# Altium schematic sheet Thiet_bi_giam_sat_IOT.SchDoc (part 1 of 3)
size 863 x 558 mm; SheetNumber: 1; SheetTotal: 1
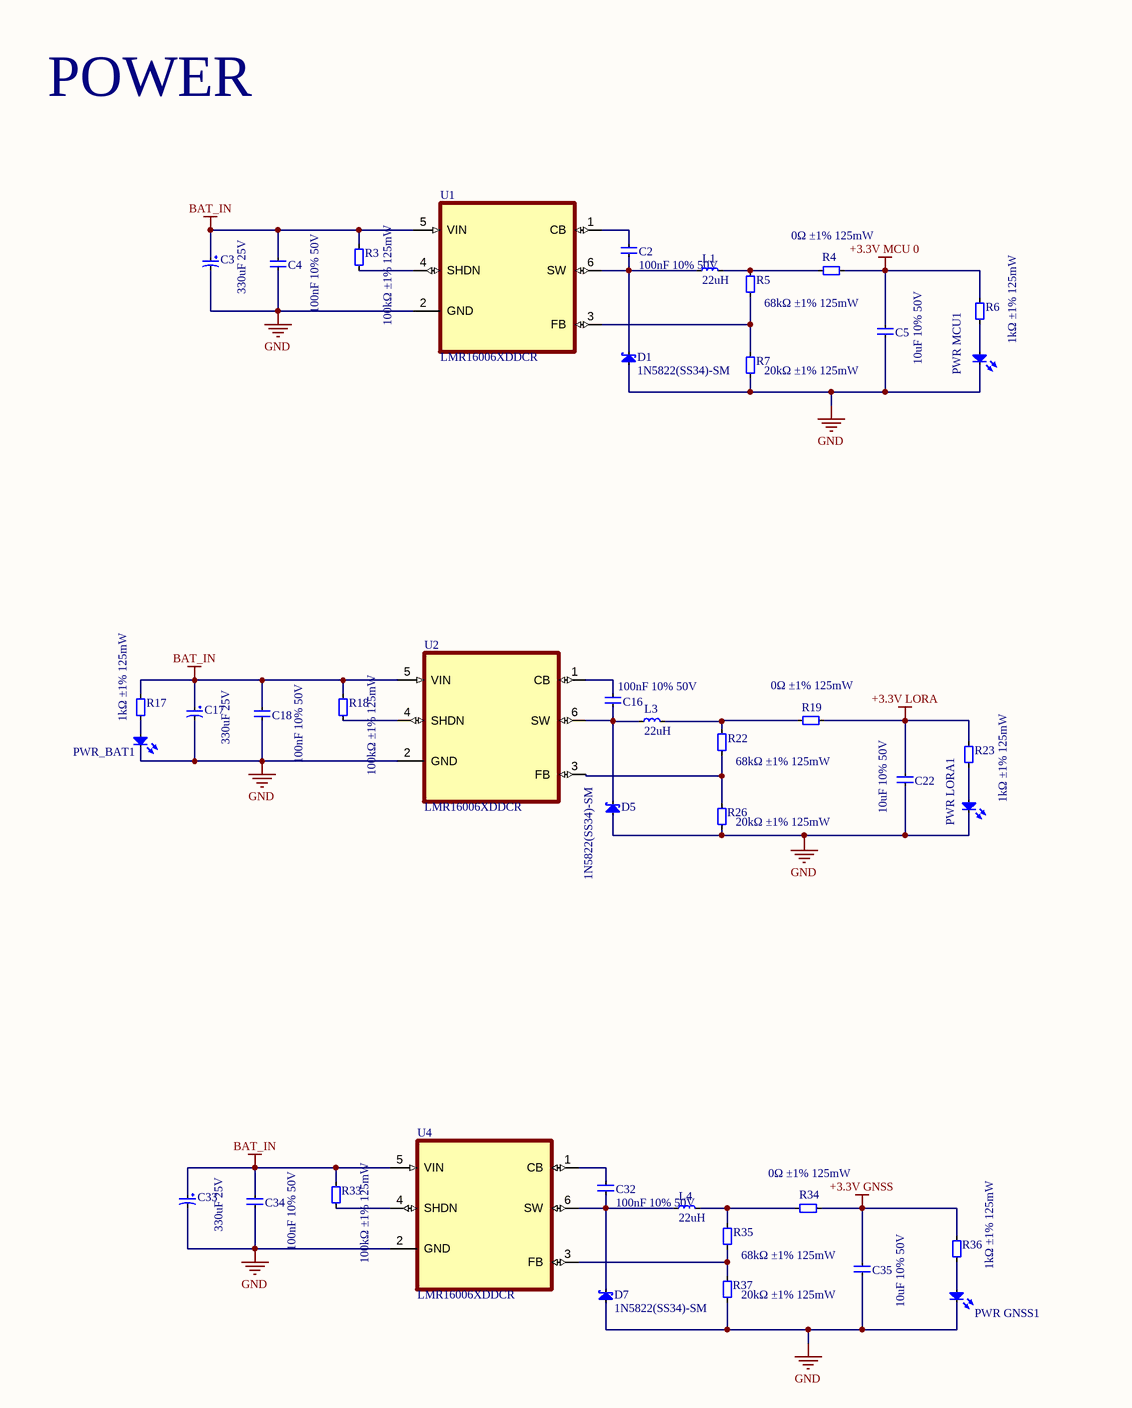
[diagram p0: Thiet_bi_giam_sat_IOT.SchDoc, top left]
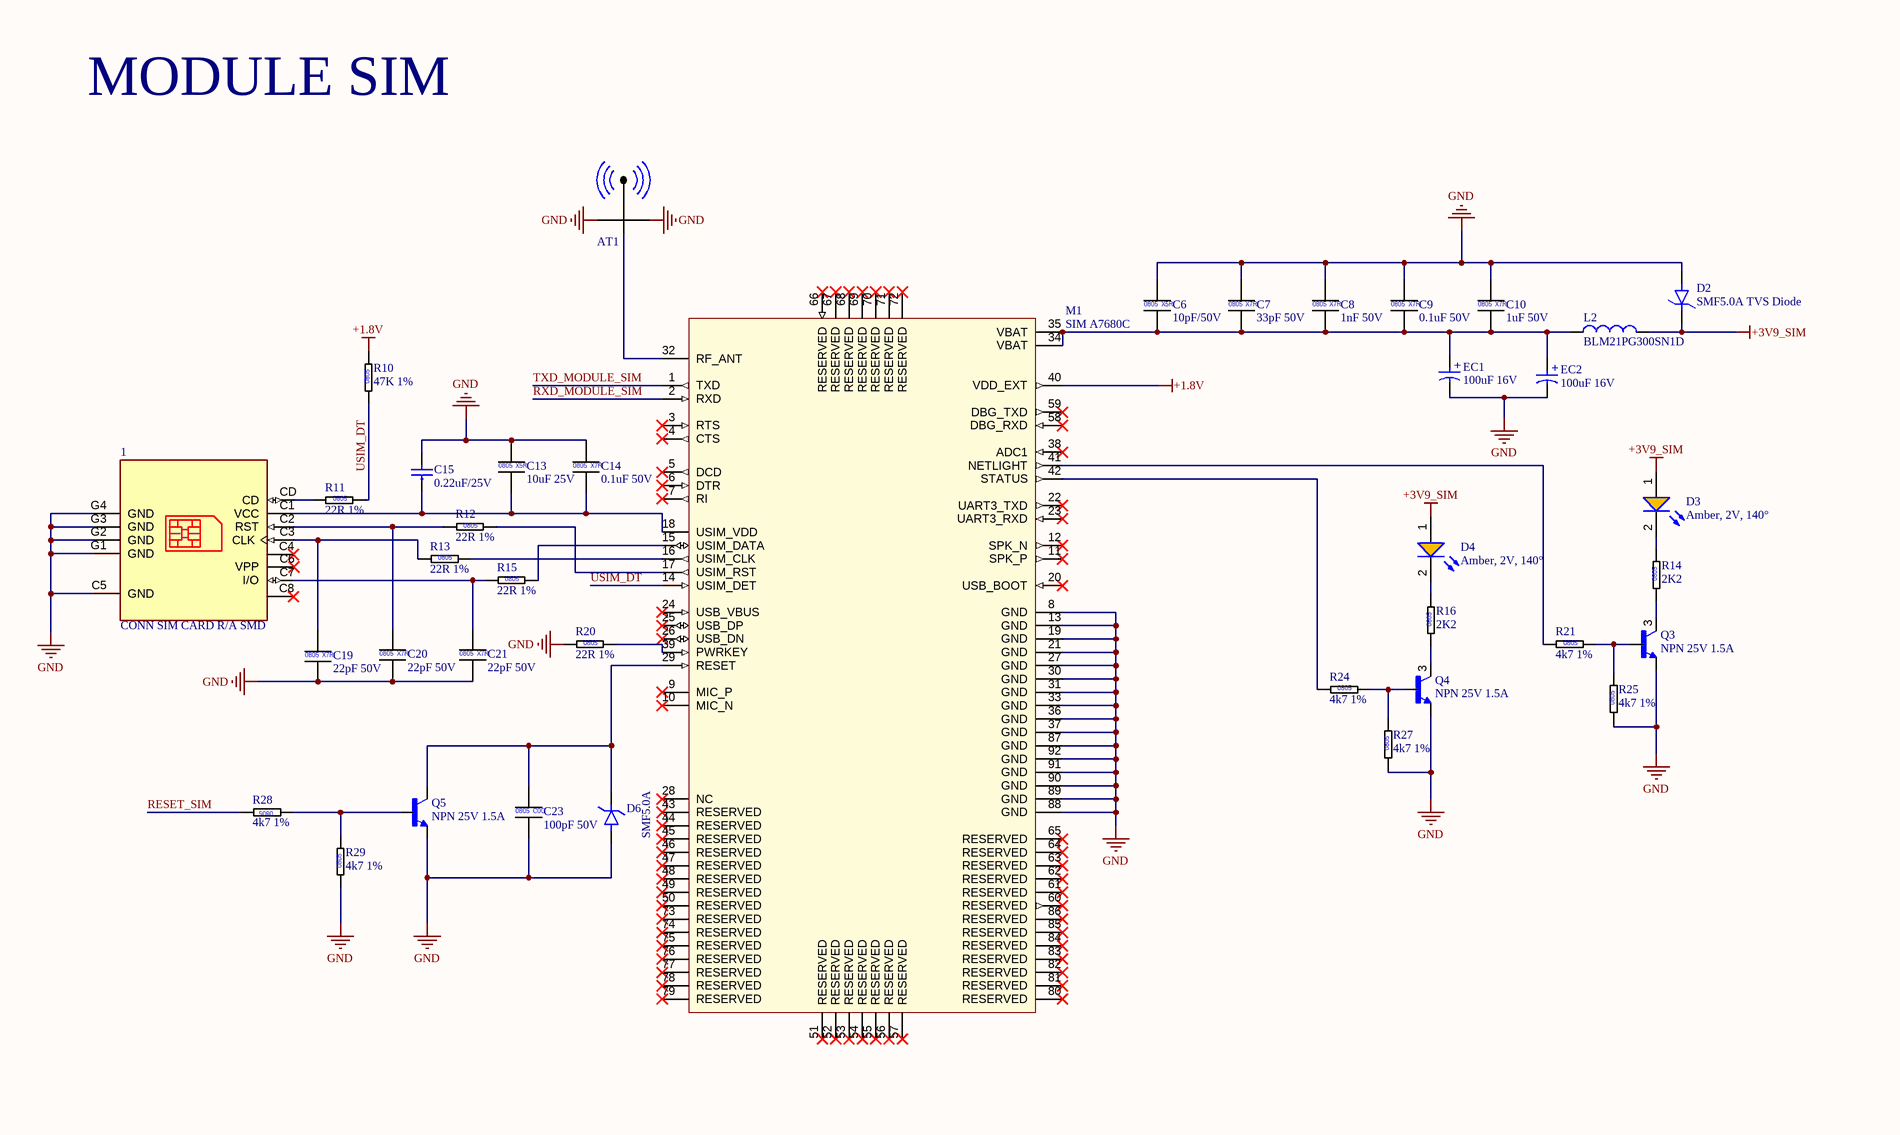
[diagram p1: Thiet_bi_giam_sat_IOT.SchDoc, top middle]
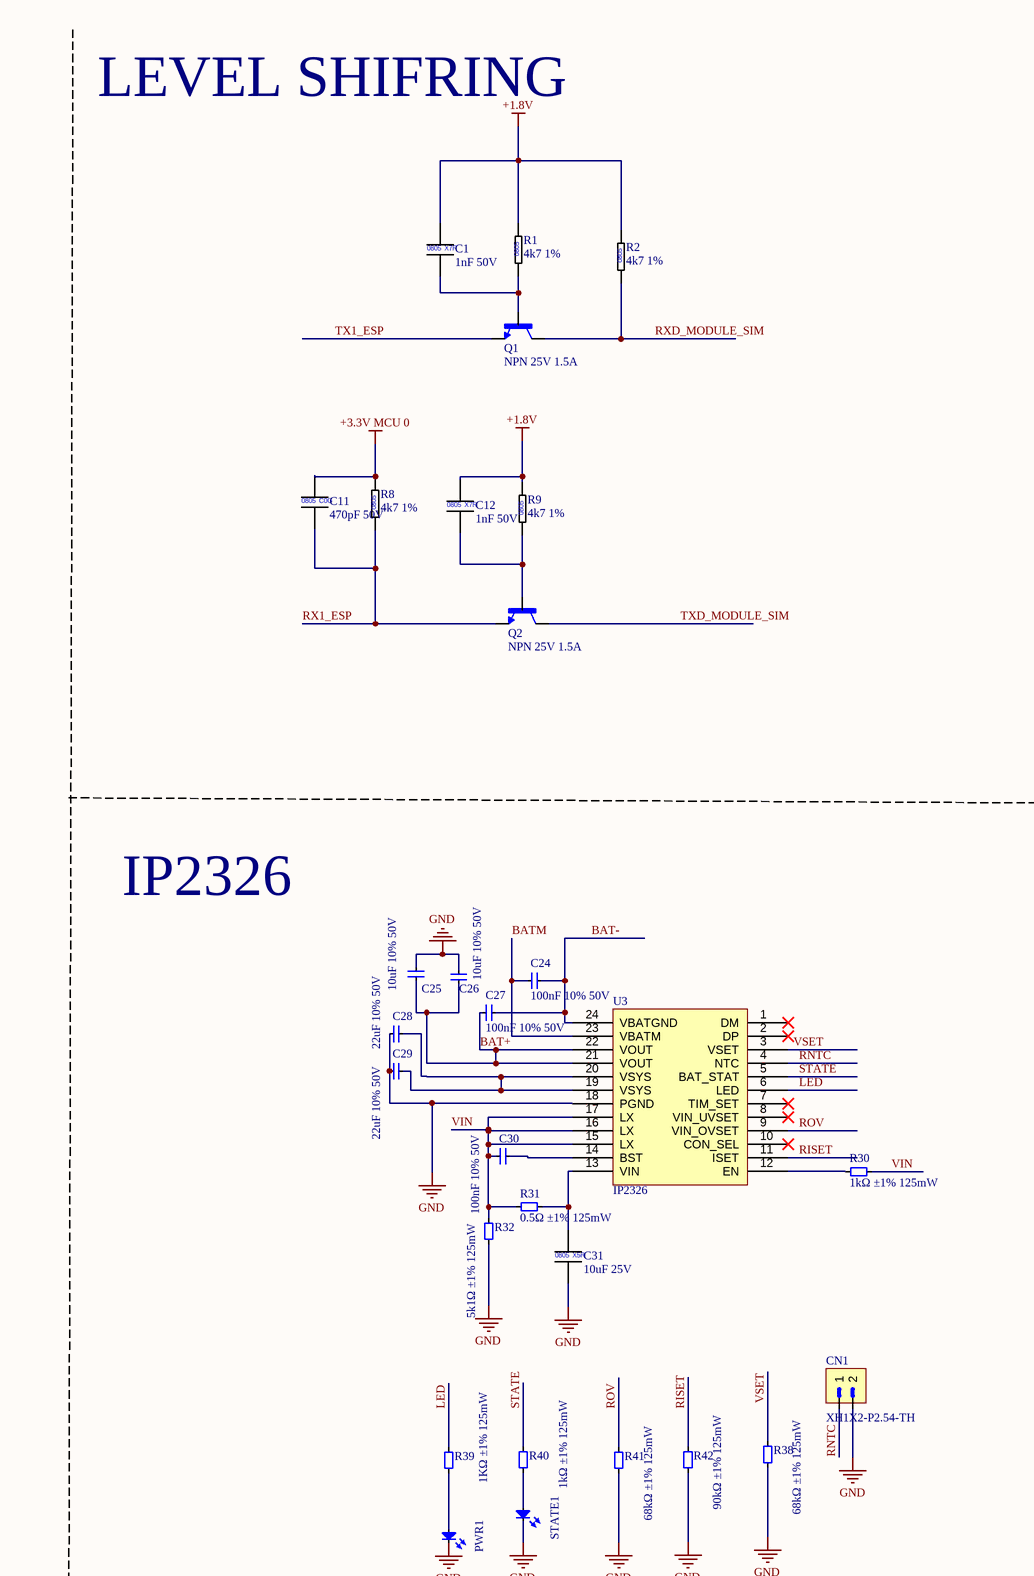
[diagram p2: Thiet_bi_giam_sat_IOT.SchDoc, top right]
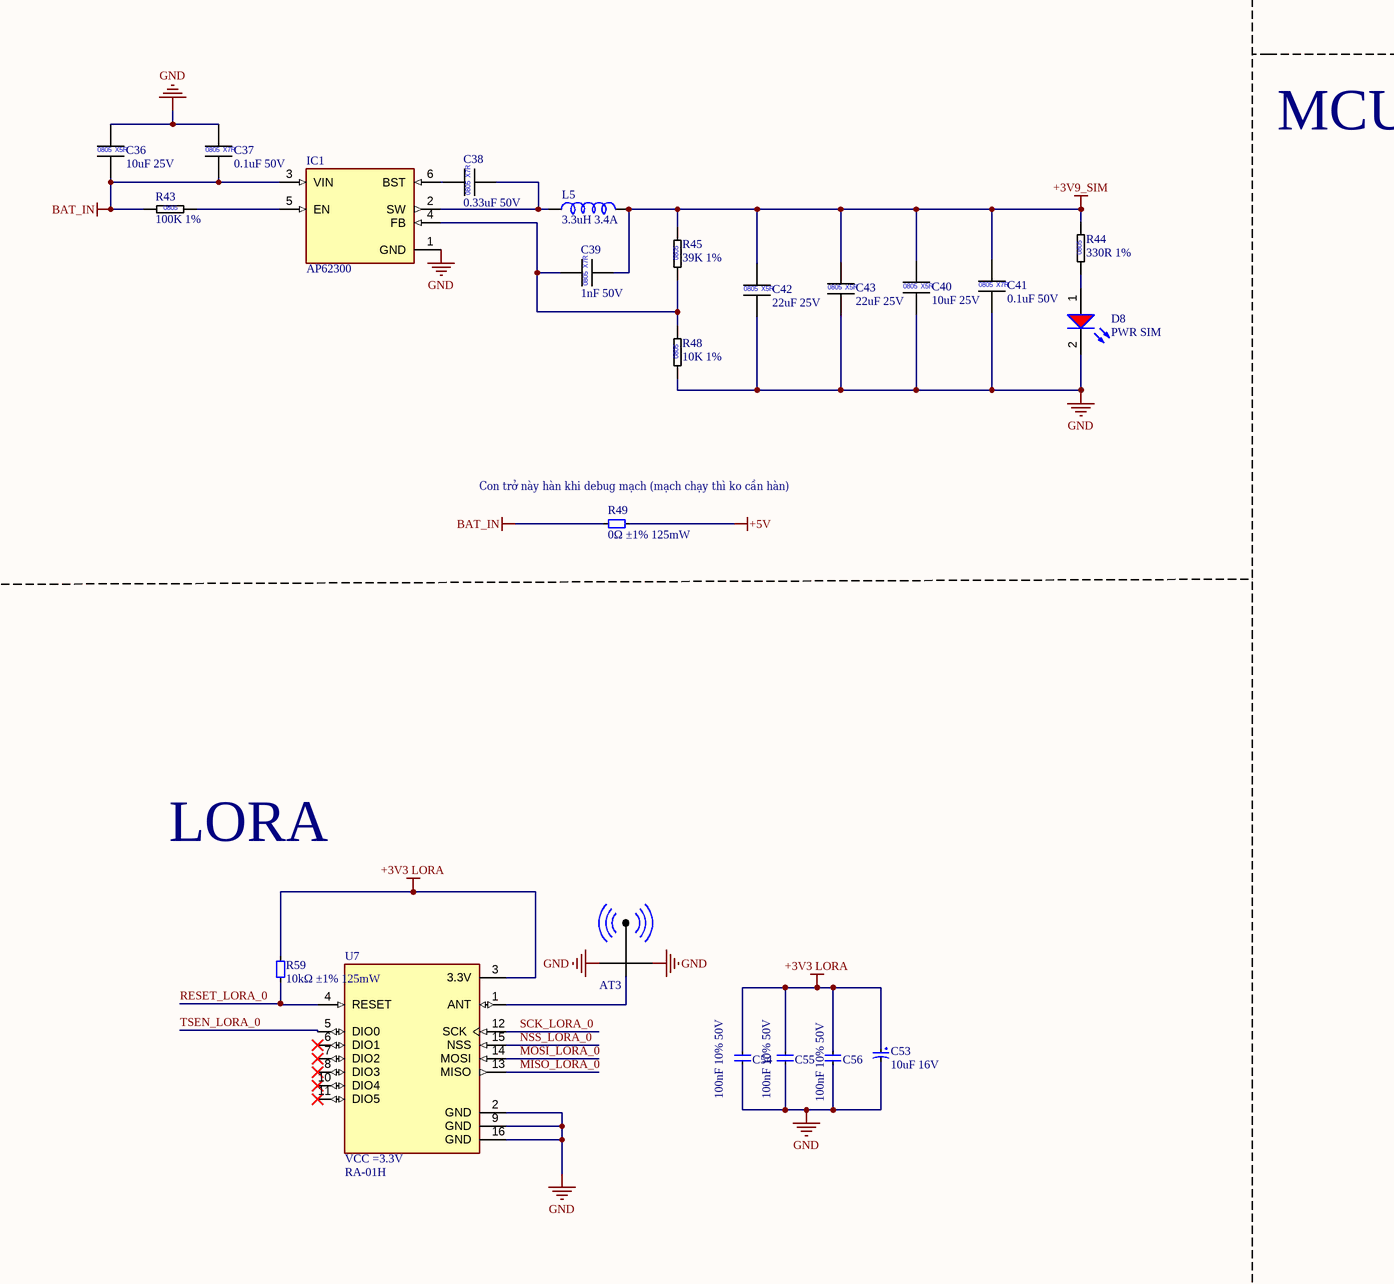
[diagram p3: Thiet_bi_giam_sat_IOT.SchDoc, bottom left]
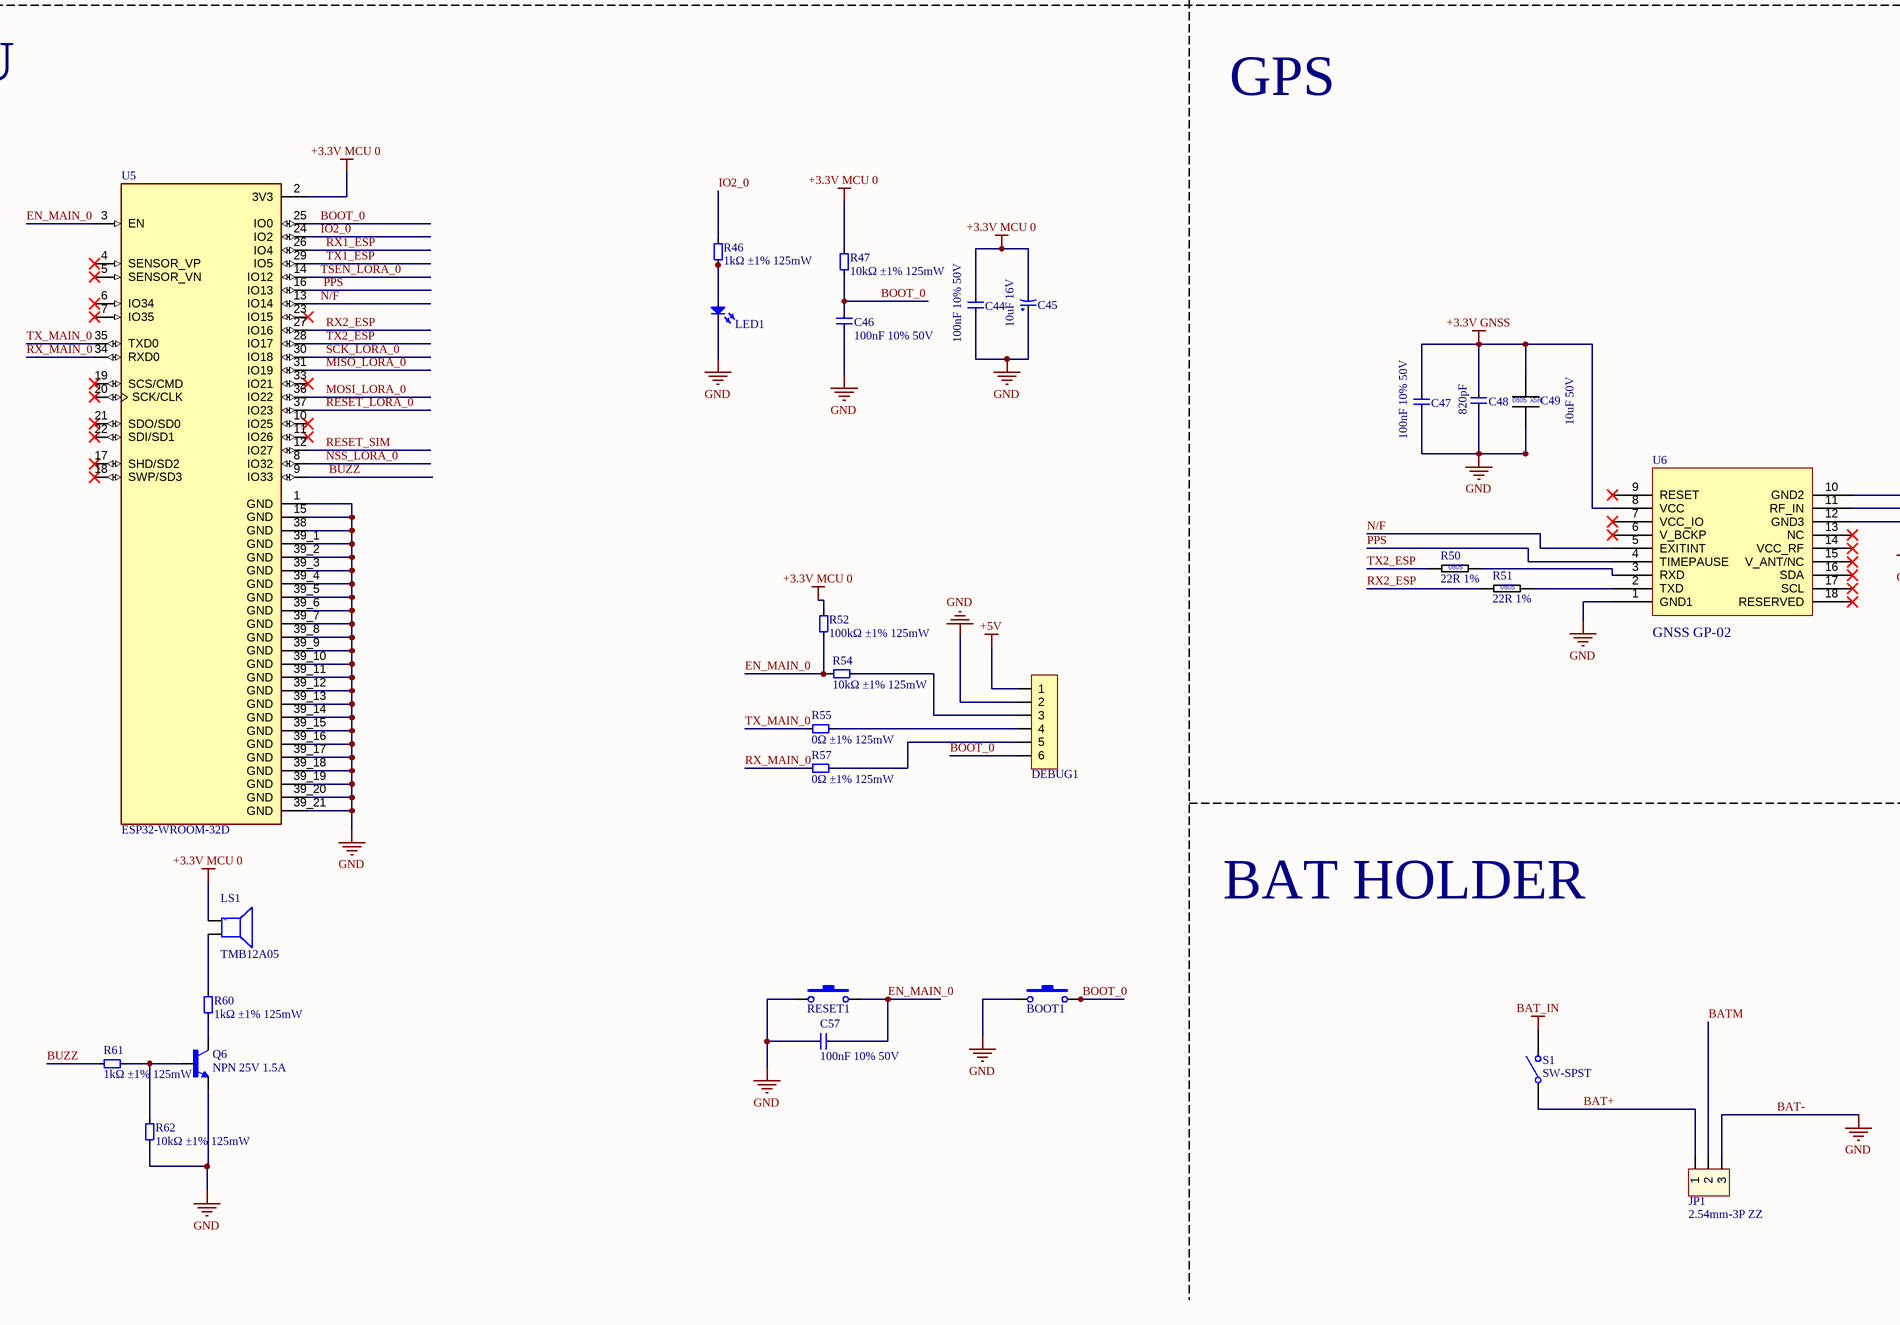
[diagram p4: Thiet_bi_giam_sat_IOT.SchDoc, bottom middle]
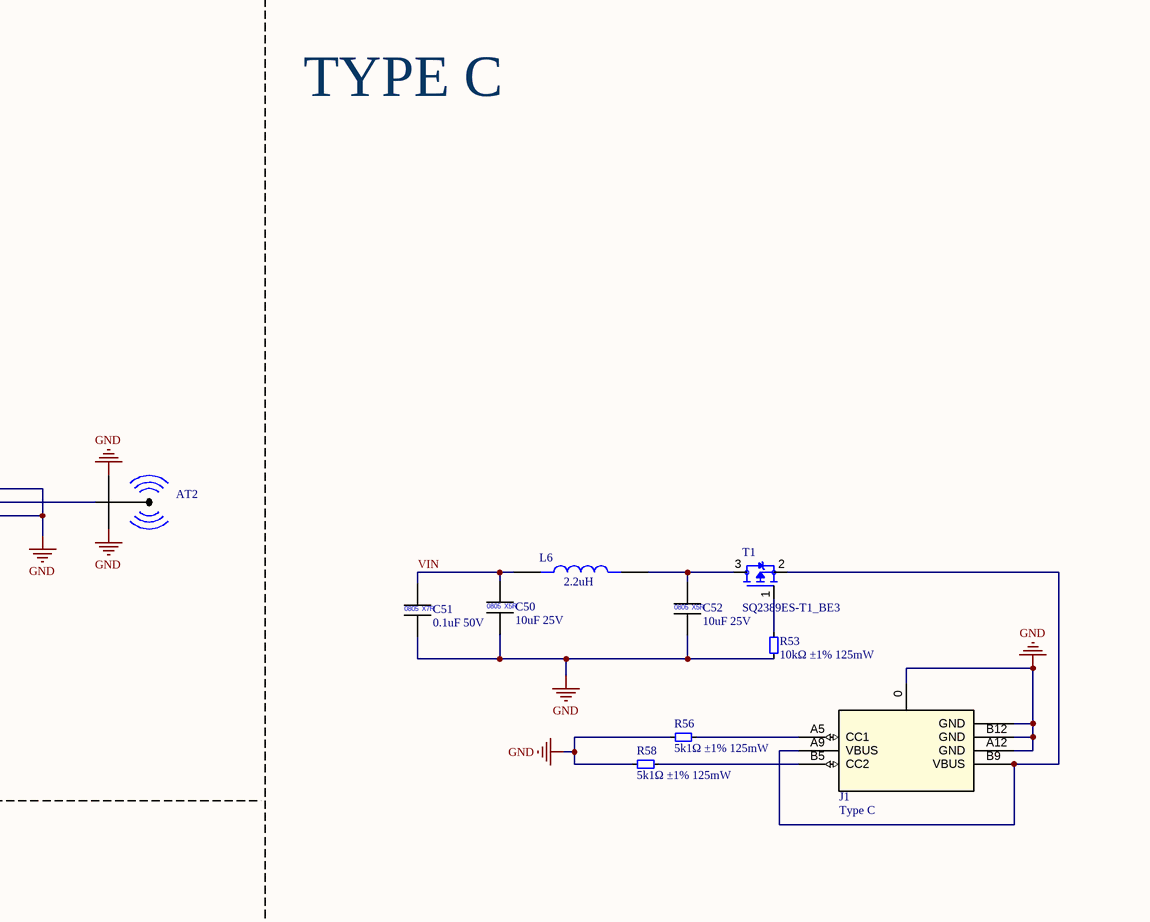
[diagram p5: Thiet_bi_giam_sat_IOT.SchDoc, bottom right]

## Parts
1  CONN SIM CARD R/A SMD  [SIM HOLDER 9P]
AT1  Antenna_IPEX  [IPEX]  (value not drawn)
AT2  Antenna_IPEX  [IPEX]  (value not drawn)
AT3  Antenna_IPEX  [IPEX]  (value not drawn)
BOOT1  Nut Nhan 2 Chan SMD 3x6x2.5  [Nut Nhan 2 Chan SMD 3x6x2.5]  (value not drawn)
C1  1nF 50V  [CAP-CER_0805_L2W1.25H0.6_Wave]
C2  100nF 10% 50V  [C-CHIP-0805-T0.95-SM]
C3  330uF 25V  [C-ELEC-ALU-F-D8.0-H10.2-SM]
C4  100nF 10% 50V  [C-CHIP-0805-T0.95-SM]
C5  10uF 10% 50V  [C-CHIP-1206-T1.00-SM]
C6  10pF/50V  [CAP-CER_0805_L2W1.25H0.6_Wave]
C7  33pF 50V  [CAP-CER_0805_L2W1.25H0.6_Wave]
C8  1nF 50V  [CAP-CER_0805_L2W1.25H0.6_Wave]
C9  0.1uF 50V  [CAP-CER_0805_L2W1.25H0.6_Wave]
C10  1uF 50V  [CAP-CER_0805_L2W1.25H0.8_Wave]
C11  470pF 50V  [CAP-CER_0805_L2W1.25H0.6_Wave]
C12  1nF 50V  [CAP-CER_0805_L2W1.25H0.6_Wave]
C13  10uF 25V  [CAP-CER_0805_L2W1.25H0.8_Wave]
C14  0.1uF 50V  [CAP-CER_0805_L2W1.25H0.6_Wave]
C15  0.22uF/25V  [CAP-CER0805-1.4H]
C16  100nF 10% 50V  [C-CHIP-0805-T0.95-SM]
C17  330uF 25V  [C-ELEC-ALU-F-D8.0-H10.2-SM]
C18  100nF 10% 50V  [C-CHIP-0805-T0.95-SM]
C19  22pF 50V  [CAP-CER_0805_L2W1.25H0.6_Wave]
C20  22pF 50V  [CAP-CER_0805_L2W1.25H0.6_Wave]
C21  22pF 50V  [CAP-CER_0805_L2W1.25H0.6_Wave]
C22  10uF 10% 50V  [C-CHIP-1206-T1.00-SM]
C23  100pF 50V  [CAP-CER_0805_L2W1.25H0.6_Wave]
C24  100nF 10% 50V  [C-CHIP-0805-T0.95-SM]
C25  10uF 10% 50V  [C-CHIP-0805-T0.95-SM]
C26  10uF 10% 50V  [C-CHIP-0805-T0.95-SM]
C27  100nF 10% 50V  [C-CHIP-0805-T0.95-SM]
C28  22uF 10% 50V  [C-CHIP-0805-T0.95-SM]
C29  22uF 10% 50V  [C-CHIP-0805-T0.95-SM]
C30  100nF 10% 50V  [C-CHIP-0805-T0.95-SM]
C31  10uF 25V  [CAP-CER_0805_L2W1.25H0.8_Wave]
C32  100nF 10% 50V  [C-CHIP-0805-T0.95-SM]
C33  330uF 25V  [C-ELEC-ALU-F-D8.0-H10.2-SM]
C34  100nF 10% 50V  [C-CHIP-0805-T0.95-SM]
C35  10uF 10% 50V  [C-CHIP-1206-T1.00-SM]
C36  10uF 25V  [CAP-CER_0805_L2W1.25H0.8_Wave]
C37  0.1uF 50V  [CAP-CER_0805_L2W1.25H0.6_Wave]
C38  0.33uF 50V  [CAP-CER_0805_L2W1.25H0.6_Wave]
C39  1nF 50V  [CAP-CER_0805_L2W1.25H0.6_Wave]
C40  10uF 25V  [CAP-CER_0805_L2W1.25H0.8_Wave]
C41  0.1uF 50V  [CAP-CER_0805_L2W1.25H0.6_Wave]
C42  22uF 25V  [CAP-CER_0805_L2W1.25H0.6_Wave]
C43  22uF 25V  [CAP-CER_0805_L2W1.25H0.6_Wave]
C44  100nF 10% 50V  [C-CHIP-0805-T0.95-SM]
C45  10uF 16V  [C-ELEC-ALU-B-D4.0-H5.4-SM]
C46  100nF 10% 50V  [C-CHIP-0805-T0.95-SM]
C47  100nF 10% 50V  [C-CHIP-0805-T0.95-SM]
C48  820pF  [C-CHIP-0805-T0.95-SM]
C49  10uF 50V  [CAP-CER_0805_L2W1.25H0.8_Wave]
C50  10uF 25V  [CAP-CER_0805_L2W1.25H0.8_Wave]
C51  0.1uF 50V  [CAP-CER_0805_L2W1.25H0.6_Wave]
C52  10uF 25V  [CAP-CER_0805_L2W1.25H0.8_Wave]
C53  10uF 16V  [C-ELEC-ALU-B-D4.0-H5.4-SM]
C54  100nF 10% 50V  [C-CHIP-0805-T0.95-SM]
C55  100nF 10% 50V  [C-CHIP-0805-T0.95-SM]
C56  100nF 10% 50V  [C-CHIP-0805-T0.95-SM]
C57  100nF 10% 50V  [C-CHIP-0805-T0.95-SM]
CN1  XH1X2-P2.54-TH  [XH1X2M-P2.54-TH]
D1  1N5822(SS34)-SM  [SMA-J_DO-214AC]
D2  SMF5.0A TVS Diode  [SOD-123]
D3  Amber, 2V, 140°  [LED_0805_AMBER]
D4  Amber, 2V, 140°  [LED_0805_AMBER]
D5  1N5822(SS34)-SM  [SMA-J_DO-214AC]
D6  SMF5.0A  [SOD-123F/SOD-123FL]
D7  1N5822(SS34)-SM  [SMA-J_DO-214AC]
D8  PWR SIM  [LED_0805_RED]
DEBUG1  DEBUG  [JP1x6F-P2.54-TH]  (value not drawn)
EC1  100uF 16V  [CAP_ALU;SMD,D6.3H5.8]
EC2  100uF 16V  [CAP_ALU;SMD,D6.3H5.8]
IC1  AP62300  [SOT-23-6]
J1  Type C  [USB_C_6P_2.00]
JP1  value 2.54mm-3P ZZ  [CONN_DIP; 3P_2.54mm; 90 DEGREE ; Black]  (hidden comment: 2.54mm-7P ZZ)
L1  22uH  [L-WIRE-CDRH74R-SM]
L2  BLM21PG300SN1D  [FB_0805_L2W1.2H0.9_HC]
L3  22uH  [L-WIRE-CDRH74R-SM]
L4  22uH  [L-WIRE-CDRH74R-SM]
L5  3.3uH 3.4A  [IND_SMD 6x6x2.8MM]
L6  2.2uH  [IND_LQH43PH2R2M26L]
LED1  LED-CHIP-SM  [LED-CHIP-0805-RD-SM]  (value not drawn)
LS1  TMB12A05  [Pin2]
M1  SIM A7680C  [IC_SIM_A7682S/A7680C - duplicate]
PWR1  LED-CHIP-SM  [LED-CHIP-0805-RD-SM]  (value not drawn)
PWR_BAT1  LED-CHIP-SM  [LED-CHIP-0805-RD-SM]  (value not drawn)
PWR_GNSS1  LED-CHIP-SM  [LED-CHIP-0805-RD-SM]  (value not drawn)
PWR_LORA1  LED-CHIP-SM  [LED-CHIP-0805-RD-SM]  (value not drawn)
PWR_MCU1  LED-CHIP-SM  [LED-CHIP-0805-RD-SM]  (value not drawn)
Q1  NPN 25V 1.5A  [MOS-FET; SOT23]
Q2  NPN 25V 1.5A  [MOS-FET; SOT23]
Q3  NPN 25V 1.5A  [MOS-FET; SOT23]
Q4  NPN 25V 1.5A  [MOS-FET; SOT23]
Q5  NPN 25V 1.5A  [MOS-FET; SOT23]
Q6  NPN 25V 1.5A  [MOS-FET; SOT23]
R1  4k7 1%  [RESISTOR_0805_Wave]
R2  4k7 1%  [RESISTOR_0805_Wave]
R3  100kΩ ±1% 125mW  [R-CHIP-0805-SM]
R4  0Ω ±1% 125mW  [R-CHIP-0805-SM]
R5  68kΩ ±1% 125mW  [R-CHIP-0805-SM]
R6  1kΩ ±1% 125mW  [R-CHIP-0805-SM]
R7  20kΩ ±1% 125mW  [R-CHIP-0805-SM]
R8  4k7 1%  [RESISTOR_0805_Wave]
R9  4k7 1%  [RESISTOR_0805_Wave]
R10  47K 1%  [RESISTOR_0805_Wave]
R11  22R 1%  [RESISTOR_0805_Wave]
R12  22R 1%  [RESISTOR_0805_Wave]
R13  22R 1%  [RESISTOR_0805_Wave]
R14  2K2  [RESISTOR_0805_Wave]
R15  22R 1%  [RESISTOR_0805_Wave]
R16  2K2  [RESISTOR_0805_Wave]
R17  1kΩ ±1% 125mW  [R-CHIP-0805-SM]
R18  100kΩ ±1% 125mW  [R-CHIP-0805-SM]
R19  0Ω ±1% 125mW  [R-CHIP-0805-SM]
R20  22R 1%  [RESISTOR_0805_Wave]
R21  4k7 1%  [RESISTOR_0805_Wave]
R22  68kΩ ±1% 125mW  [R-CHIP-0805-SM]
R23  1kΩ ±1% 125mW  [R-CHIP-0805-SM]
R24  4k7 1%  [RESISTOR_0805_Wave]
R25  4k7 1%  [RESISTOR_0805_Wave]
R26  20kΩ ±1% 125mW  [R-CHIP-0805-SM]
R27  4k7 1%  [RESISTOR_0805_Wave]
R28  4k7 1%  [RESISTOR_0805_Wave]
R29  4k7 1%  [RESISTOR_0805_Wave]
R30  1kΩ ±1% 125mW  [R-CHIP-0805-SM]
R31  0.5Ω ±1% 125mW  [R-CHIP-0805-SM]
R32  5k1Ω ±1% 125mW  [R-CHIP-0805-SM]
R33  100kΩ ±1% 125mW  [R-CHIP-0805-SM]
R34  0Ω ±1% 125mW  [R-CHIP-0805-SM]
R35  68kΩ ±1% 125mW  [R-CHIP-0805-SM]
R36  1kΩ ±1% 125mW  [R-CHIP-0805-SM]
R37  20kΩ ±1% 125mW  [R-CHIP-0805-SM]
R38  68kΩ ±1% 125mW  [R-CHIP-0805-SM]
R39  1KΩ ±1% 125mW  [R-CHIP-0805-SM]
R40  1kΩ ±1% 125mW  [R-CHIP-0805-SM]
R41  68kΩ ±1% 125mW  [R-CHIP-0805-SM]
R42  90kΩ ±1% 125mW  [R-CHIP-0805-SM]
R43  100K 1%  [RESISTOR_0805_Wave]
R44  330R 1%  [RESISTOR_0805_Wave]
R45  39K 1%  [RESISTOR_0805_Wave]
R46  1kΩ ±1% 125mW  [R-CHIP-0805-SM]
R47  10kΩ ±1% 125mW  [R-CHIP-0805-SM]
R48  10K 1%  [RESISTOR_0805_Wave]
R49  0Ω ±1% 125mW  [R-CHIP-0805-SM]
R50  22R 1%  [RESISTOR_0805_Wave]
R51  22R 1%  [RESISTOR_0805_Wave]
R52  100kΩ ±1% 125mW  [R-CHIP-0805-SM]
R53  10kΩ ±1% 125mW  [R-CHIP-0805-SM]
R54  10kΩ ±1% 125mW  [R-CHIP-0805-SM]
R55  0Ω ±1% 125mW  [R-CHIP-0805-SM]
R56  5k1Ω ±1% 125mW  [R-CHIP-0805-SM]
R57  0Ω ±1% 125mW  [R-CHIP-0805-SM]
R58  5k1Ω ±1% 125mW  [R-CHIP-0805-SM]
R59  10kΩ ±1% 125mW  [R-CHIP-0805-SM]
R60  1kΩ ±1% 125mW  [R-CHIP-0805-SM]
R61  1kΩ ±1% 125mW  [R-CHIP-0805-SM]
R62  10kΩ ±1% 125mW  [R-CHIP-0805-SM]
RESET1  Nut Nhan 2 Chan SMD 3x6x2.5  [Nut Nhan 2 Chan SMD 3x6x2.5]  (value not drawn)
S1  SW-SPST  [SPST-2]
STATE1  LED-CHIP-SM  [LED-CHIP-0805-RD-SM]  (value not drawn)
T1  SQ2389ES-T1_BE3  [SOT-23]
U1  LMR16006XDDCR  [SOT-6L]
U2  LMR16006XDDCR  [SOT-6L]
U3  IP2326  [IP2326]
U4  LMR16006XDDCR  [SOT-6L]
U5  ESP32-WROOM-32D  [MCU_ESP32-WROOM-32D]
U6  GNSS GP-02  [GNSS_GP-02]  (value not drawn)
U7  VCC =3.3V  Manufacture Part Number: RA-01H  [MCU_RA-01H]

## Nets
+1.8V: C1.1 C12.1 M1.40(VDD_EXT) R1.2 R2.2 R9.2 R10.2
+3.3V GNSS: C35.2 C47.2 C48.2 C49.1 R34.2 R36.2 U6.8(VCC)
+3.3V LORA: C22.2 R19.2 R23.2
+3.3V MCU 0: C5.2 C11.1 C44.2 C45.2 LS1.1(+) R4.2 R6.2 R8.2 R47.2 R52.2 U5.2(3V3)
+3V3 LORA: C53.1 C54.2 C55.2 C56.2 R59.2 U7.3(3.3V)
+3V9_SIM: C39.2 C40.1 C41.1 C42.1 C43.1 D2.2(K) D3.1(A) D4.1(A) L2.2 L5.2 R44.2 R45.2
+5V: DEBUG1.1 R49.2
BAT-: 1.C5(GND) 1.G1(GND) 1.G2(GND) 1.G3(GND) 1.G4(GND) AT1.2(GND) AT2.2(GND) AT3.2(GND) BOOT1.1 C3.2 C4.1 C5.1 C6.1 C7.1 C8.1 C9.1 C10.1 C13.1 C14.1 C15.2 C17.2 C18.1 C19.2 C20.2 C21.2 C22.1 C23.2 C24.2 C25.2 C26.2 C27.2 C28.1 C29.1 C31.2 C33.2 C34.1 C35.1 C36.1 C37.1 C40.2 C41.2 C42.2 C43.2 C44.1 C45.1 C46.1 C47.1 C48.1 C49.2 C50.2 C51.2 C52.2 C53.2 C54.1 C55.1 C56.1 C57.2 CN1.2 D1.1 D2.1(A) D5.1 D6.1(A) D7.1 D8.2(K) DEBUG1.2 EC1.2(N) EC2.2(N) IC1.1(GND) J1.0(GND) J1.A12(GND) J1.B12(GND) JP1.3 LED1.2 M1.8(GND) M1.13(GND) M1.19(GND) M1.21(GND) M1.27(GND) M1.30(GND) M1.31(GND) M1.33(GND) M1.36(GND) M1.37(GND) M1.87(GND) M1.88(GND) M1.89(GND) M1.90(GND) M1.91(GND) M1.92(GND) PWR1.2 PWR_BAT1.2 PWR_GNSS1.2 PWR_LORA1.2 PWR_MCU1.2 Q3.2(E) Q4.2(E) Q5.2(E) Q6.2(E) R7.1 R20.1 R25.1 R26.1 R27.1 R29.1 R32.1 R37.1 R38.1 R41.1 R42.1 R48.1 R53.1 R56.1 R58.1 R62.1 RESET1.1 STATE1.2 U1.2(GND) U2.2(GND) U3.18(PGND) U3.24(VBATGND) U4.2(GND) U5.1(GND) U5.15(GND) U5.38(GND) U5.39_1(GND) U5.39_2(GND) U5.39_3(GND) U5.39_4(GND) U5.39_5(GND) U5.39_6(GND) U5.39_7(GND) U5.39_8(GND) U5.39_9(GND) U5.39_10(GND) U5.39_11(GND) U5.39_12(GND) U5.39_13(GND) U5.39_14(GND) U5.39_15(GND) U5.39_16(GND) U5.39_17(GND) U5.39_18(GND) U5.39_19(GND) U5.39_20(GND) U5.39_21(GND) U6.1(GND1) U6.10(GND2) U6.12(GND3) U7.2(GND) U7.9(GND) U7.16(GND)  [also labelled GND]
BAT_IN: C3.1 C4.2 C17.1 C18.2 C33.1 C34.2 C36.2 C37.2 IC1.3(VIN) R3.2 R17.2 R18.2 R33.2 R43.1 R49.1 S1.2(NO) U1.5(VIN) U2.5(VIN) U4.5(VIN)
BAT+: C25.1 C26.1 C27.1 JP1.1 S1.1(COMMON) U3.21(VOUT) U3.22(VOUT)
BATM: C24.1 JP1.2 U3.23(VBATM)
BOOT_0: BOOT1.2 C46.2 DEBUG1.6 R47.1 U5.25(IO0)
BUZZ: R61.2 U5.9(IO33)
EN_MAIN_0: C57.1 R52.1 R54.1 RESET1.2 U5.3(EN)
IO2_0: R46.2 U5.24(IO2)
LED: R39.2 U3.6(LED)
MISO_LORA_0: U5.31(IO19) U7.13(MISO)
MOSI_LORA_0: U5.36(IO22) U7.14(MOSI)
N/F: U5.13(IO14) U6.5(EXITINT)
NSS_LORA_0: U5.8(IO32) U7.15(NSS)
PPS: U5.16(IO13) U6.4(TIMEPAUSE)
RESET_LORA_0: R59.1 U5.37(IO23) U7.4(RESET)
RESET_SIM: R28.2 U5.12(IO27)
RISET: R42.2 U3.11(ISET)
RNTC: CN1.1 U3.4(NTC)
ROV: R41.2 U3.9(VIN_OVSET)
RX1_ESP: C11.2 Q2.2(E) R8.1 U5.26(IO4)
RX2_ESP: R51.1 U5.27(IO16)
RX_MAIN_0: R57.1 U5.34(RXD0)
RXD_MODULE_SIM: M1.2(RXD) Q1.3(C) R2.1
SCK_LORA_0: U5.30(IO18) U7.12(SCK)
STATE: R40.2 U3.5(BAT_STAT)
TSEN_LORA_0: U5.14(IO12) U7.5(DIO0)
TX1_ESP: Q1.2(E) U5.29(IO5)
TX2_ESP: R50.1 U5.28(IO17)
TX_MAIN_0: R55.1 U5.35(TXD0)
TXD_MODULE_SIM: M1.1(TXD) Q2.3(C)
USIM_DT: M1.14(USIM_DET) R10.1 R11.2
VIN: C30.1 C50.1 C51.1 L6.1 R30.2 R31.1 R32.2 U3.15(LX) U3.16(LX) U3.17(LX)
VSET: R38.2 U3.3(VSET)
Net1_C1: 1.C1(VCC) C13.2 C14.2 C15.1 M1.18(USIM_VDD)
Net1_C2: 1.C2(RST) C20.1 R12.1
Net1_C3: 1.C3(CLK) C19.1 R13.1
Net1_C7: 1.C7(I/O) C21.1 R15.1
Net1_CD: 1.CD R11.1
NetAT1_1: AT1.1(AT) M1.32(RF_ANT)
NetAT2_1: AT2.1(AT) U6.11(RF_IN)
NetAT3_1: AT3.1(AT) U7.1(ANT)
NetC1_2: C1.2 Q1.1(B) R1.1
NetC2_1: C2.1 D1.2 L1.1 U1.6(SW)
NetC2_2: C2.2 U1.1(CB)
NetC6_2: C6.2 C7.2 C8.2 C9.2 C10.2 EC1.1(P) EC2.1(P) L2.1 M1.34(VBAT) M1.35(VBAT)
NetC12_2: C12.2 Q2.1(B) R9.1
NetC16_1: C16.1 D5.2 L3.1 U2.6(SW)
NetC16_2: C16.2 U2.1(CB)
NetC23_1: C23.1 D6.2(K) M1.29(RESET) Q5.3(C)
NetC28_2: C28.2 C29.2 U3.19(VSYS) U3.20(VSYS)
NetC30_2: C30.2 U3.14(BST)
NetC31_1: C31.1 R31.2 U3.13(VIN)
NetC32_1: C32.1 D7.2 L4.1 U4.6(SW)
NetC32_2: C32.2 U4.1(CB)
NetC38_1: C38.1 IC1.6(BST)
NetC38_2: C38.2 IC1.2(SW) L5.1
NetC39_1: C39.1 IC1.4(FB) R45.1 R48.2
NetC52_1: C52.1 L6.2 T1.3(D)
NetD3_2: D3.2(K) R14.2
NetD4_2: D4.2(K) R16.2
NetD8_1: D8.1(A) R44.1
NetDEBUG1_3: DEBUG1.3 R54.2
NetDEBUG1_4: DEBUG1.4 R55.2
NetDEBUG1_5: DEBUG1.5 R57.2
NetIC1_5: IC1.5(EN) R43.2
NetJ1_A5: J1.A5(CC1) R56.2
NetJ1_A9: J1.A9(VBUS) J1.B9(VBUS) T1.2(S)
NetJ1_B5: J1.B5(CC2) R58.2
NetL1_2: L1.2 R4.1 R5.2
NetL3_2: L3.2 R19.1 R22.2
NetL4_2: L4.2 R34.1 R35.2
NetLED1_1: LED1.1 R46.1
NetLS1_2: LS1.2(-) R60.1
NetM1_15: M1.15(USIM_DATA) R15.2
NetM1_16: M1.16(USIM_CLK) R13.2
NetM1_17: M1.17(USIM_RST) R12.2
NetM1_39: M1.39(PWRKEY) R20.2
NetM1_41: M1.41(NETLIGHT) R21.1
NetM1_42: M1.42(STATUS) R24.1
NetPWR1_1: PWR1.1 R39.1
NetPWR_BAT1_1: PWR_BAT1.1 R17.1
NetPWR_GNSS1_1: PWR_GNSS1.1 R36.1
NetPWR_LORA1_1: PWR_LORA1.1 R23.1
NetPWR_MCU1_1: PWR_MCU1.1 R6.1
NetQ3_1: Q3.1(B) R21.2 R25.2
NetQ3_3: Q3.3(C) R14.1
NetQ4_1: Q4.1(B) R24.2 R27.2
NetQ4_3: Q4.3(C) R16.1
NetQ5_1: Q5.1(B) R28.1 R29.2
NetQ6_1: Q6.1(B) R61.1 R62.2
NetQ6_3: Q6.3(C) R60.2
NetR3_1: R3.1 U1.4(SHDN)
NetR5_1: R5.1 R7.2 U1.3(FB)
NetR18_1: R18.1 U2.4(SHDN)
NetR22_1: R22.1 R26.2 U2.3(FB)
NetR30_1: R30.1 U3.12(EN)
NetR33_1: R33.1 U4.4(SHDN)
NetR35_1: R35.1 R37.2 U4.3(FB)
NetR40_1: R40.1 STATE1.1
NetR50_2: R50.2 U6.3(RXD)
NetR51_2: R51.2 U6.2(TXD)
NetR53_2: R53.2 T1.1(G)

Not connected (* = marked no-connect by the designer): 1 C4* C6(VPP)* C8*; M1 3(RTS)* 4(CTS)* 5(DCD)* 6(DTR)* 7(RI)* 9(MIC_P)* 10(MIC_N)* 11(SPK_P)* 12(SPK_N)* 20(USB_BOOT)* 22(UART3_TXD)* 23(UART3_RXD)* 24(USB_VBUS)* 25(USB_DP)* 26(USB_DN)* 28(NC)* 38(ADC1)* 43(RESERVED)* 44(RESERVED)* 45(RESERVED)* 46(RESERVED)* 47(RESERVED)* 48(RESERVED)* 49(RESERVED)* 50(RESERVED)* 51(RESERVED)* 52(RESERVED)* 53(RESERVED)* 54(RESERVED)* 55(RESERVED)* 56(RESERVED)* 57(RESERVED)* 58(DBG_RXD)* 59(DBG_TXD)* 60(RESERVED)* 61(RESERVED)* 62(RESERVED)* 63(RESERVED)* 64(RESERVED)* 65(RESERVED)* 66(RESERVED)* 67(RESERVED)* 68(RESERVED)* 69(RESERVED)* 70(RESERVED)* 71(RESERVED)* 72(RESERVED)* 73(RESERVED)* 74(RESERVED)* 75(RESERVED)* 76(RESERVED)* 77(RESERVED)* 78(RESERVED)* 79(RESERVED)* 80(RESERVED)* 81(RESERVED)* 82(RESERVED)* 83(RESERVED)* 84(RESERVED)* 85(RESERVED)* 86(RESERVED)*; U3 1(DM)* 2(DP)* 7(TIM_SET)* 8(VIN_UVSET)* 10(CON_SEL)*; U5 4(SENSOR_VP)* 5(SENSOR_VN)* 6(IO34)* 7(IO35)* 10(IO25)* 11(IO26)* 17(SHD/SD2)* 18(SWP/SD3)* 19(SCS/CMD)* 20(SCK/CLK)* 21(SDO/SD0)* 22(SDI/SD1)* 23(IO15)* 33(IO21)*; U6 6(V_BCKP)* 7(VCC_IO)* 9(RESET)* 13(NC)* 14(VCC_RF)* 15(V_ANT/NC)* 16(SDA)* 17(SCL)* 18(RESERVED)*; U7 6(DIO1)* 7(DIO2)* 8(DIO3)* 10(DIO4)* 11(DIO5)*

## Notes on the sheet
- LEVEL SHIFRING
- POWER
- MODULE SIM
- IP2326
- MCU
- GPS
- TYPE C
- (near R49) Con trở này hàn khi debug mạch (mạch chạy thì ko cần hàn)
- LORA
- BAT HOLDER
- DWG. NO.
- REV.
- SHT.
- REVISION
- DESCRIPTION
- DATE
- APPROVED
- THIS DOCUMENT AND THE DATA DISCLOSED HEREIN OR HEREWITH IS THE PROPERTY OF ALTIUM LIMITED AND MAY BE FREELY DISTRIBUTED IN WHOLE. NO RIGHTS ARE RESERVED OR EXPRESS OR IMPLIED WARANTEE GIVEN.
- ENG:
- DSN:
- APPROVALS
- PROJECT
- DOCUMENT REVISION:
- DESIGN ITEM:
- CHK:
- BOM:
- REFERENCE DOCUMENTS
- PROJECT REVISION:
- TITLE
- FAB DWG:
- PCB DWG:
- ASSY DWG:
- SCALE:
- SIZE
- D
- CAGE CODE
- FILE NAME
- DWG NO.
- SHEET
- OF
- REV
- (in symbol CAP_ALU_SMD; 100UF 20% 16V 6.3x5.5MM) +
- (in symbol CAP_CER_SMD; 0.33UF 50V X7R 0805 10%) X7R
- (in symbol CAP_CER_SMD; 10PF 50V C0G/NP0 0805 2.5%) X5R
- (in symbol CAP_CER_SMD; 22PF 50V C0G/NP0 0805 5%) X7R
- (in symbol CAP_CER_SMD; 33PF 50V C0G/NP0 0805 10%) X7R
- (in symbol CAP_CER_SMD; 100PF 50V C0G/NP0 0805 10%) 0805; C0G
- (in symbol CAP_CER_SMD; 470PF 50V C0G/NP0 0805 5%) C0G
- (in symbol RES_SMD; 4.7K, 1%, 0805, 1/8W) 0805
- (in symbol RES_SMD; 10K, 1%, 0805, 1/8W) 0805
- (in symbol RES_SMD; 22R, 1%, 0805, 1/8W) 0805
- (in symbol RES_SMD; 330R, 1%, 0805, 1/8W) 0805